# Altium schematic sheet Underwater_ROV_ESCS.SchDoc
size A
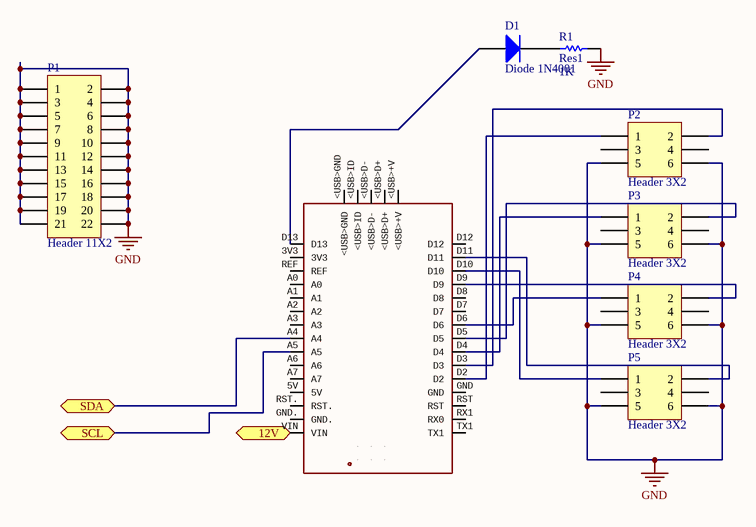
[diagram p0: Underwater_ROV_ESCS.SchDoc]

## Parts
D1  Diode 1N4001  [DO-41]
P1  Header 11X2  [HDR2X11]
P2  Header 3X2  [HDR2X3]
P3  Header 3X2  [HDR2X3]
P4  Header 3X2  [HDR2X3]
P5  Header 3X2  [HDR2X3]
PCB?  Device for representing an Arduino Nano board with a footprint in an EAGLE design. Created by Dave Young for Element14. More EAGLE documentation at: http://www.element14.com/community/community/knode/cadsoft_eagle  [ARDUINO_NANO]  (value not drawn)
R1  Res1  value 1K  [AXIAL-0.3]

## Ports
12V (bidir), SCL (bidir), SDA (bidir)

## Nets
GND: P1.1 P1.2 P1.3 P1.4 P1.5 P1.6 P1.7 P1.8 P1.9 P1.10 P1.11 P1.12 P1.13 P1.14 P1.15 P1.16 P1.17 P1.18 P1.19 P1.20 P1.21 P1.22 P2.5 P2.6 P3.5 P3.6 P4.5 P4.6 P5.5 P5.6 R1.2
12V: PCB?.VIN ; port 12V
SCL: PCB?.A5 ; port SCL
SDA: PCB?.A4 ; port SDA
NetD1_1: D1.1(A) PCB?.D13
NetD1_2: D1.2(K) R1.1
NetP2_1: P2.1 PCB?.D2
NetP2_2: P2.2 PCB?.D3
NetP3_1: P3.1 PCB?.D4
NetP3_2: P3.2 PCB?.D5
NetP4_1: P4.1 PCB?.D6
NetP4_2: P4.2 PCB?.D9
NetP5_1: P5.1 PCB?.D10
NetP5_2: P5.2 PCB?.D11

Not connected (* = marked no-connect by the designer): P2 3 4; P3 3 4; P4 3 4; P5 3 4; PCB? 3V3 5V 5V. <USB>+V <USB>D+ <USB>D- <USB>GND <USB>ID A0 A1 A2 A3 A6 A7 D7 D8 D12 GND GND. GND_ MISO MOSI REF RESET.. RST RST. RX1(RX0) SCK TX1

## Library data of the parts
D1 = Diode 1N4001: 1 Amp General Purpose Rectifier; Published: 8-Jun-2000; LatestRevisionDate: 17-Jul-2002; LatestRevisionNote: Re-released for DXP Platform.; DatasheetVersion: 1998; PackageVersion: Aug-1999; PackageReference: DO-41; Publisher: Altium Limited; PackageDescription: Diode, Axial; Body 5.2 x 2.7 mm (LxDia. max), Lead Dia. 0.86 mm (max); Code_JEDEC: DO-204-AL; ComponentLink1Description: Manufacturer Link; ComponentLink1URL: http://www.fairchildsemi.com/; ComponentLink2Description: Datasheet; ComponentLink2URL: http://www.fairchildsemi.com/ds/1N%2F1N4001.pdf
P1 = Header 11X2: Header, 11-Pin, Dual row; LatestRevisionDate: 17-Jul-2002; LatestRevisionNote: Re-released for DXP Platform.; Publisher: Altium Limited
P2-P5 = Header 3X2: Header, 3-Pin, Dual row; LatestRevisionDate: 17-Jul-2002; LatestRevisionNote: Re-released for DXP Platform.; Publisher: Altium Limited
PCB? = ARDUINO_NANO
R1 = Res1: Resistor; Published: 8-Jun-2000; LatestRevisionDate: 17-Jul-2002; LatestRevisionNote: Re-released for DXP Platform.; PackageReference: AXIAL-0.3; Publisher: Altium Limited; PackageDescription: Axial Device, Thru-Hole; 2 Leads; 0.3 in Pin Spacing